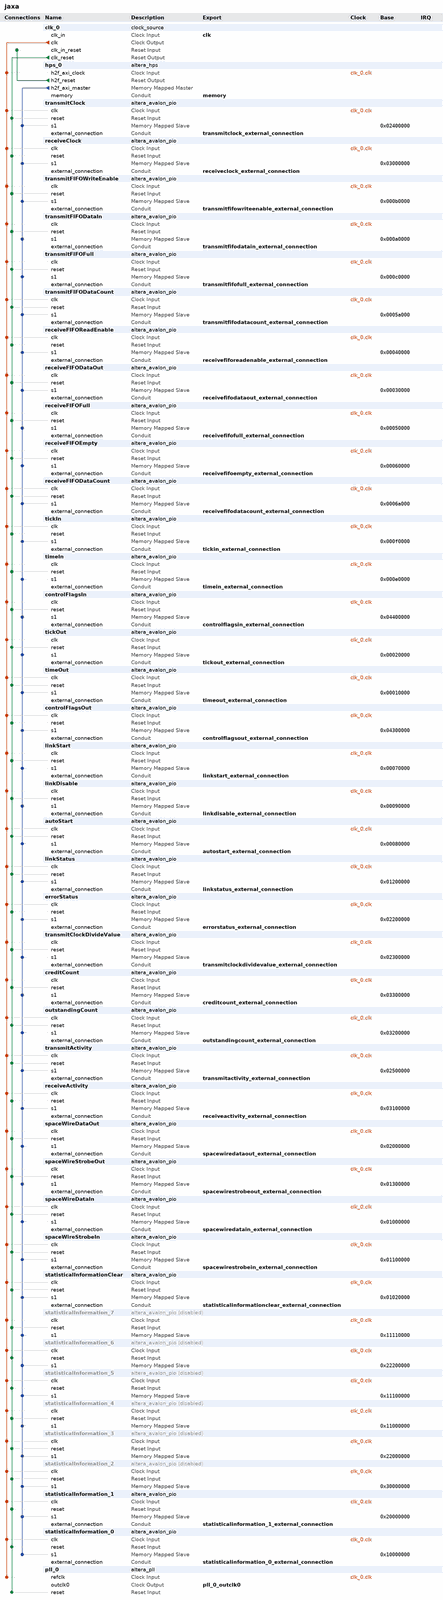
[diagram p0: system contents, whole]
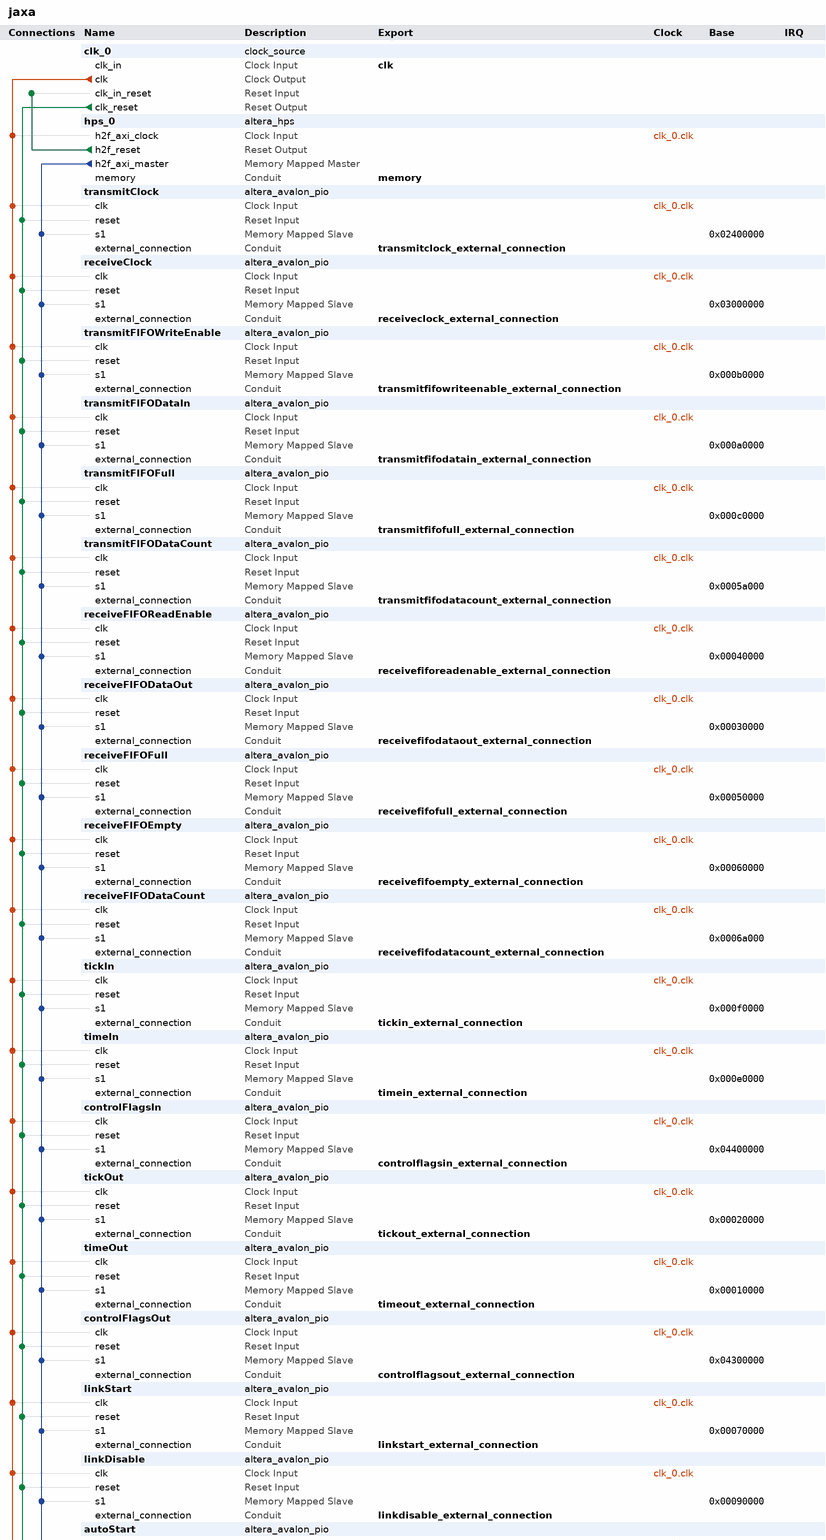
[diagram p1: system contents, upper part]
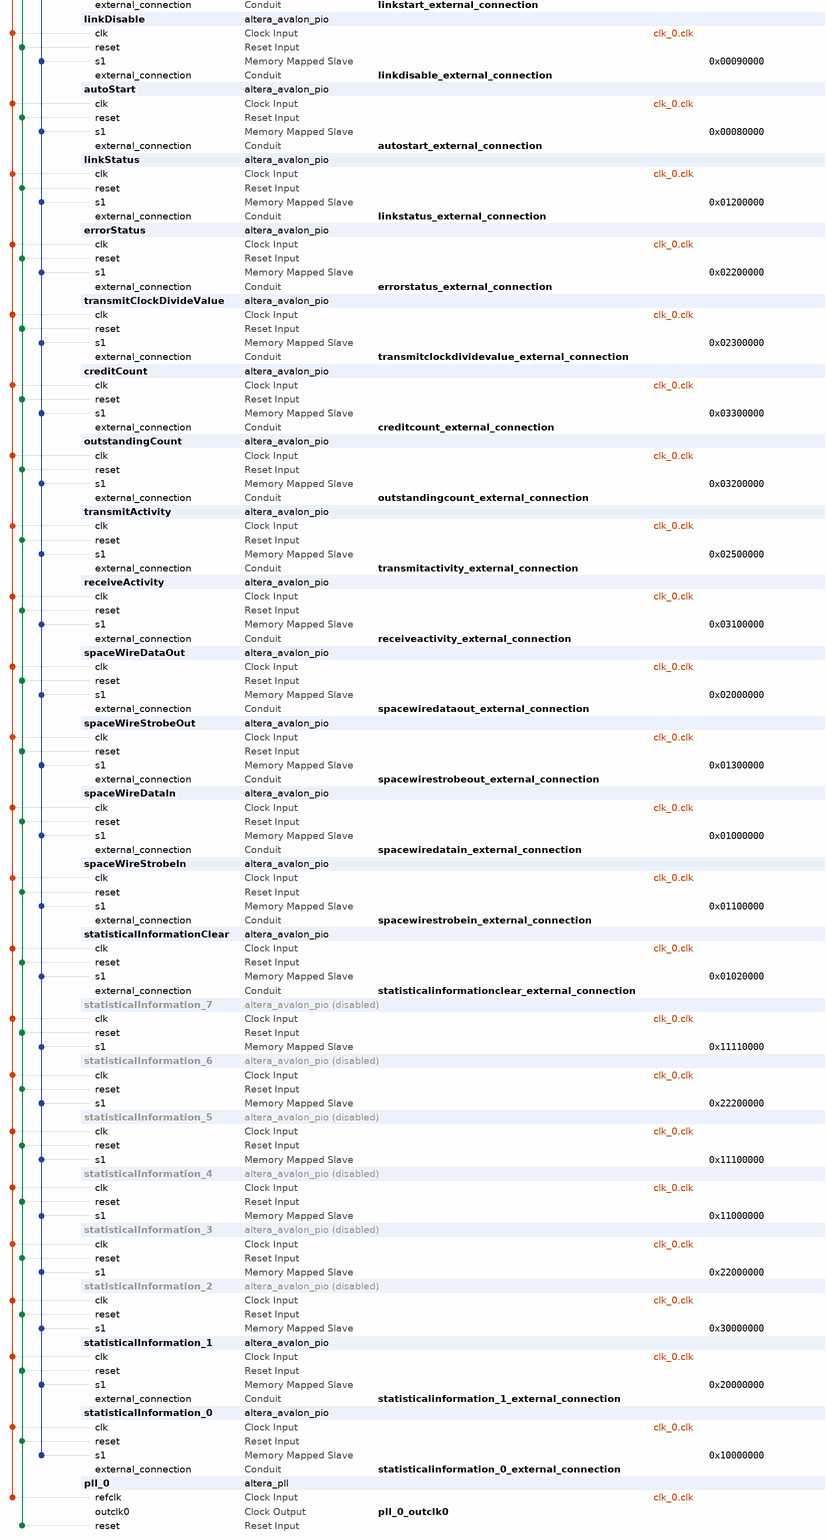
[diagram p2: system contents, lower part]
# Platform Designer (Qsys) system jaxa, Cyclone V 5CSEMA4U23C6
# Parameters at their usual value, and those the tool derives, are not listed.
package require -exact qsys 17.1
create_system jaxa
set_project_property DEVICE_FAMILY {Cyclone V}
set_project_property DEVICE 5CSEMA4U23C6

add_instance clk_0 clock_source 17.1
set_instance_parameter_value clk_0 clockFrequency 50000000

add_instance hps_0 altera_hps 17.1
set_instance_parameter_value hps_0 EMAC1_Mode N/A
set_instance_parameter_value hps_0 EMAC1_PinMuxing Unused
set_instance_parameter_value hps_0 F2SCLK_COLDRST_Enable false
set_instance_parameter_value hps_0 F2SCLK_DBGRST_Enable false
set_instance_parameter_value hps_0 F2SCLK_WARMRST_Enable false
set_instance_parameter_value hps_0 F2SINTERRUPT_Enable false
set_instance_parameter_value hps_0 F2S_Width 0
set_instance_parameter_value hps_0 FPGA_PERIPHERAL_OUTPUT_CLOCK_FREQ_EMAC0_GTX_CLK 125
set_instance_parameter_value hps_0 FPGA_PERIPHERAL_OUTPUT_CLOCK_FREQ_EMAC0_MD_CLK 2.5
set_instance_parameter_value hps_0 FPGA_PERIPHERAL_OUTPUT_CLOCK_FREQ_EMAC1_GTX_CLK 125
set_instance_parameter_value hps_0 FPGA_PERIPHERAL_OUTPUT_CLOCK_FREQ_EMAC1_MD_CLK 2.5
set_instance_parameter_value hps_0 HPS_PROTOCOL DDR3
set_instance_parameter_value hps_0 I2C0_Mode N/A
set_instance_parameter_value hps_0 I2C0_PinMuxing Unused
set_instance_parameter_value hps_0 I2C1_Mode N/A
set_instance_parameter_value hps_0 I2C1_PinMuxing Unused
set_instance_parameter_value hps_0 LWH2F_Enable false
set_instance_parameter_value hps_0 MEM_BANKADDR_WIDTH 3
set_instance_parameter_value hps_0 MEM_CLK_FREQ 300.0
set_instance_parameter_value hps_0 MEM_CLK_FREQ_MAX 400.0
set_instance_parameter_value hps_0 MEM_COL_ADDR_WIDTH 8
set_instance_parameter_value hps_0 MEM_DQ_WIDTH 8
set_instance_parameter_value hps_0 MEM_DRV_STR RZQ/6
set_instance_parameter_value hps_0 MEM_ROW_ADDR_WIDTH 12
set_instance_parameter_value hps_0 MEM_RTT_NOM {ODT Disabled}
set_instance_parameter_value hps_0 MEM_RTT_WR {Dynamic ODT off}
set_instance_parameter_value hps_0 MEM_TCL 7
set_instance_parameter_value hps_0 MEM_TFAW_NS 37.5
set_instance_parameter_value hps_0 MEM_TINIT_US 499
set_instance_parameter_value hps_0 MEM_TMRD_CK 3
set_instance_parameter_value hps_0 MEM_TRAS_NS 40.0
set_instance_parameter_value hps_0 MEM_TRCD_NS 15.0
set_instance_parameter_value hps_0 MEM_TREFI_US 7.0
set_instance_parameter_value hps_0 MEM_TRFC_NS 75.0
set_instance_parameter_value hps_0 MEM_TRP_NS 15.0
set_instance_parameter_value hps_0 MEM_TWTR 2
set_instance_parameter_value hps_0 MEM_VENDOR JEDEC
set_instance_parameter_value hps_0 MEM_WTCL 6
set_instance_parameter_value hps_0 QSPI_Mode N/A
set_instance_parameter_value hps_0 QSPI_PinMuxing Unused
set_instance_parameter_value hps_0 REF_CLK_FREQ 125.0
set_instance_parameter_value hps_0 S2FCLK_USER2CLK 5
set_instance_parameter_value hps_0 S2F_Width 1
set_instance_parameter_value hps_0 SDIO_Mode N/A
set_instance_parameter_value hps_0 SDIO_PinMuxing Unused
set_instance_parameter_value hps_0 SPIM1_Mode N/A
set_instance_parameter_value hps_0 SPIM1_PinMuxing Unused
set_instance_parameter_value hps_0 STM_Enable false
set_instance_parameter_value hps_0 TIMING_BOARD_AC_SKEW 0.02
set_instance_parameter_value hps_0 TIMING_BOARD_AC_TO_CK_SKEW 0.0
set_instance_parameter_value hps_0 TIMING_BOARD_DQ_TO_DQS_SKEW 0.0
set_instance_parameter_value hps_0 TIMING_BOARD_MAX_CK_DELAY 0.6
set_instance_parameter_value hps_0 TIMING_BOARD_MAX_DQS_DELAY 0.6
set_instance_parameter_value hps_0 TIMING_BOARD_SKEW_BETWEEN_DQS 0.02
set_instance_parameter_value hps_0 TIMING_BOARD_SKEW_CKDQS_DIMM_MAX 0.01
set_instance_parameter_value hps_0 TIMING_BOARD_SKEW_CKDQS_DIMM_MIN -0.01
set_instance_parameter_value hps_0 TIMING_BOARD_SKEW_WITHIN_DQS 0.02
set_instance_parameter_value hps_0 TIMING_TDH 125
set_instance_parameter_value hps_0 TIMING_TDQSCK 400
set_instance_parameter_value hps_0 TIMING_TDQSQ 120
set_instance_parameter_value hps_0 TIMING_TDS 50
set_instance_parameter_value hps_0 TIMING_TIH 250
set_instance_parameter_value hps_0 TIMING_TIS 175
set_instance_parameter_value hps_0 TIMING_TQSH 0.38
set_instance_parameter_value hps_0 UART0_Mode N/A
set_instance_parameter_value hps_0 UART0_PinMuxing Unused
set_instance_parameter_value hps_0 USB1_Mode N/A
set_instance_parameter_value hps_0 USB1_PinMuxing Unused
set_instance_parameter_value hps_0 desired_cfg_clk_mhz 100.0
set_instance_parameter_value hps_0 desired_qspi_clk_mhz 400.0
set_instance_parameter_value hps_0 eosc1_clk_mhz 50.0
set_instance_parameter_value hps_0 eosc2_clk_mhz 50.0

add_instance transmitClock altera_avalon_pio 17.1
set_instance_parameter_value transmitClock direction Output
set_instance_parameter_value transmitClock width 1

add_instance receiveClock altera_avalon_pio 17.1
set_instance_parameter_value receiveClock direction Output
set_instance_parameter_value receiveClock width 1

add_instance transmitFIFOWriteEnable altera_avalon_pio 17.1
set_instance_parameter_value transmitFIFOWriteEnable direction Output
set_instance_parameter_value transmitFIFOWriteEnable width 1

add_instance transmitFIFODataIn altera_avalon_pio 17.1
set_instance_parameter_value transmitFIFODataIn direction Output
set_instance_parameter_value transmitFIFODataIn width 9

add_instance transmitFIFOFull altera_avalon_pio 17.1
set_instance_parameter_value transmitFIFOFull direction Input
set_instance_parameter_value transmitFIFOFull width 1

add_instance transmitFIFODataCount altera_avalon_pio 17.1
set_instance_parameter_value transmitFIFODataCount direction Input
set_instance_parameter_value transmitFIFODataCount width 6

add_instance receiveFIFOReadEnable altera_avalon_pio 17.1
set_instance_parameter_value receiveFIFOReadEnable direction Output
set_instance_parameter_value receiveFIFOReadEnable width 1

add_instance receiveFIFODataOut altera_avalon_pio 17.1
set_instance_parameter_value receiveFIFODataOut direction Input
set_instance_parameter_value receiveFIFODataOut width 9

add_instance receiveFIFOFull altera_avalon_pio 17.1
set_instance_parameter_value receiveFIFOFull direction Input
set_instance_parameter_value receiveFIFOFull width 1

add_instance receiveFIFOEmpty altera_avalon_pio 17.1
set_instance_parameter_value receiveFIFOEmpty direction Input
set_instance_parameter_value receiveFIFOEmpty width 1

add_instance receiveFIFODataCount altera_avalon_pio 17.1
set_instance_parameter_value receiveFIFODataCount direction Input
set_instance_parameter_value receiveFIFODataCount width 1

add_instance tickIn altera_avalon_pio 17.1
set_instance_parameter_value tickIn direction Output
set_instance_parameter_value tickIn width 1

add_instance timeIn altera_avalon_pio 17.1
set_instance_parameter_value timeIn direction Output
set_instance_parameter_value timeIn width 6

add_instance controlFlagsIn altera_avalon_pio 17.1
set_instance_parameter_value controlFlagsIn direction Output
set_instance_parameter_value controlFlagsIn width 2

add_instance tickOut altera_avalon_pio 17.1
set_instance_parameter_value tickOut direction Input
set_instance_parameter_value tickOut width 1

add_instance timeOut altera_avalon_pio 17.1
set_instance_parameter_value timeOut direction Input
set_instance_parameter_value timeOut width 6

add_instance controlFlagsOut altera_avalon_pio 17.1
set_instance_parameter_value controlFlagsOut direction Input
set_instance_parameter_value controlFlagsOut width 2

add_instance linkStart altera_avalon_pio 17.1
set_instance_parameter_value linkStart direction Output
set_instance_parameter_value linkStart width 1

add_instance linkDisable altera_avalon_pio 17.1
set_instance_parameter_value linkDisable direction Output
set_instance_parameter_value linkDisable width 1

add_instance autoStart altera_avalon_pio 17.1
set_instance_parameter_value autoStart direction Output
set_instance_parameter_value autoStart width 1

add_instance linkStatus altera_avalon_pio 17.1
set_instance_parameter_value linkStatus direction Input
set_instance_parameter_value linkStatus width 16

add_instance errorStatus altera_avalon_pio 17.1
set_instance_parameter_value errorStatus direction Input
set_instance_parameter_value errorStatus width 8

add_instance transmitClockDivideValue altera_avalon_pio 17.1
set_instance_parameter_value transmitClockDivideValue direction Output
set_instance_parameter_value transmitClockDivideValue width 6

add_instance creditCount altera_avalon_pio 17.1
set_instance_parameter_value creditCount direction Input
set_instance_parameter_value creditCount width 6

add_instance outstandingCount altera_avalon_pio 17.1
set_instance_parameter_value outstandingCount direction Input
set_instance_parameter_value outstandingCount width 6

add_instance transmitActivity altera_avalon_pio 17.1
set_instance_parameter_value transmitActivity direction Input
set_instance_parameter_value transmitActivity width 1

add_instance receiveActivity altera_avalon_pio 17.1
set_instance_parameter_value receiveActivity direction Input
set_instance_parameter_value receiveActivity width 1

add_instance spaceWireDataOut altera_avalon_pio 17.1
set_instance_parameter_value spaceWireDataOut direction Input
set_instance_parameter_value spaceWireDataOut width 1

add_instance spaceWireStrobeOut altera_avalon_pio 17.1
set_instance_parameter_value spaceWireStrobeOut direction Input
set_instance_parameter_value spaceWireStrobeOut width 1

add_instance spaceWireDataIn altera_avalon_pio 17.1
set_instance_parameter_value spaceWireDataIn direction Output
set_instance_parameter_value spaceWireDataIn width 1

add_instance spaceWireStrobeIn altera_avalon_pio 17.1
set_instance_parameter_value spaceWireStrobeIn direction Output
set_instance_parameter_value spaceWireStrobeIn width 1

add_instance statisticalInformationClear altera_avalon_pio 17.1
set_instance_parameter_value statisticalInformationClear direction Output
set_instance_parameter_value statisticalInformationClear width 1

add_instance statisticalInformation_7 altera_avalon_pio 17.1
set_instance_property statisticalInformation_7 ENABLED false
set_instance_parameter_value statisticalInformation_7 direction Input
set_instance_parameter_value statisticalInformation_7 width 32

add_instance statisticalInformation_6 altera_avalon_pio 17.1
set_instance_property statisticalInformation_6 ENABLED false
set_instance_parameter_value statisticalInformation_6 direction Input
set_instance_parameter_value statisticalInformation_6 width 32

add_instance statisticalInformation_5 altera_avalon_pio 17.1
set_instance_property statisticalInformation_5 ENABLED false
set_instance_parameter_value statisticalInformation_5 direction Input
set_instance_parameter_value statisticalInformation_5 width 32

add_instance statisticalInformation_4 altera_avalon_pio 17.1
set_instance_property statisticalInformation_4 ENABLED false
set_instance_parameter_value statisticalInformation_4 direction Input
set_instance_parameter_value statisticalInformation_4 width 32

add_instance statisticalInformation_3 altera_avalon_pio 17.1
set_instance_property statisticalInformation_3 ENABLED false
set_instance_parameter_value statisticalInformation_3 direction Input
set_instance_parameter_value statisticalInformation_3 width 32

add_instance statisticalInformation_2 altera_avalon_pio 17.1
set_instance_property statisticalInformation_2 ENABLED false
set_instance_parameter_value statisticalInformation_2 direction Input
set_instance_parameter_value statisticalInformation_2 width 32

add_instance statisticalInformation_1 altera_avalon_pio 17.1
set_instance_parameter_value statisticalInformation_1 direction Output
set_instance_parameter_value statisticalInformation_1 width 8

add_instance statisticalInformation_0 altera_avalon_pio 17.1
set_instance_parameter_value statisticalInformation_0 direction Input
set_instance_parameter_value statisticalInformation_0 width 32

add_instance pll_0 altera_pll 17.1
set_instance_parameter_value pll_0 gui_device_speed_grade 1
set_instance_parameter_value pll_0 gui_number_of_clocks 1
set_instance_parameter_value pll_0 gui_operation_mode direct
set_instance_parameter_value pll_0 gui_output_clock_frequency0 100.0
set_instance_parameter_value pll_0 gui_pll_mode {Integer-N PLL}
set_instance_parameter_value pll_0 gui_reference_clock_frequency 100.0
set_instance_parameter_value pll_0 gui_use_locked true

# connections
add_connection clk_0.clk autoStart.clk clock
add_connection clk_0.clk controlFlagsIn.clk clock
add_connection clk_0.clk controlFlagsOut.clk clock
add_connection clk_0.clk creditCount.clk clock
add_connection clk_0.clk errorStatus.clk clock
add_connection clk_0.clk hps_0.h2f_axi_clock clock
add_connection clk_0.clk linkDisable.clk clock
add_connection clk_0.clk linkStart.clk clock
add_connection clk_0.clk linkStatus.clk clock
add_connection clk_0.clk outstandingCount.clk clock
add_connection clk_0.clk pll_0.refclk clock
add_connection clk_0.clk receiveActivity.clk clock
add_connection clk_0.clk receiveClock.clk clock
add_connection clk_0.clk receiveFIFODataCount.clk clock
add_connection clk_0.clk receiveFIFODataOut.clk clock
add_connection clk_0.clk receiveFIFOEmpty.clk clock
add_connection clk_0.clk receiveFIFOFull.clk clock
add_connection clk_0.clk receiveFIFOReadEnable.clk clock
add_connection clk_0.clk spaceWireDataIn.clk clock
add_connection clk_0.clk spaceWireDataOut.clk clock
add_connection clk_0.clk spaceWireStrobeIn.clk clock
add_connection clk_0.clk spaceWireStrobeOut.clk clock
add_connection clk_0.clk statisticalInformation_0.clk clock
add_connection clk_0.clk statisticalInformation_1.clk clock
add_connection clk_0.clk statisticalInformation_2.clk clock
add_connection clk_0.clk statisticalInformation_3.clk clock
add_connection clk_0.clk statisticalInformation_4.clk clock
add_connection clk_0.clk statisticalInformation_5.clk clock
add_connection clk_0.clk statisticalInformation_6.clk clock
add_connection clk_0.clk statisticalInformation_7.clk clock
add_connection clk_0.clk statisticalInformationClear.clk clock
add_connection clk_0.clk tickIn.clk clock
add_connection clk_0.clk tickOut.clk clock
add_connection clk_0.clk timeIn.clk clock
add_connection clk_0.clk timeOut.clk clock
add_connection clk_0.clk transmitActivity.clk clock
add_connection clk_0.clk transmitClock.clk clock
add_connection clk_0.clk transmitClockDivideValue.clk clock
add_connection clk_0.clk transmitFIFODataCount.clk clock
add_connection clk_0.clk transmitFIFODataIn.clk clock
add_connection clk_0.clk transmitFIFOFull.clk clock
add_connection clk_0.clk transmitFIFOWriteEnable.clk clock
add_connection clk_0.clk_reset autoStart.reset reset
add_connection clk_0.clk_reset controlFlagsIn.reset reset
add_connection clk_0.clk_reset controlFlagsOut.reset reset
add_connection clk_0.clk_reset creditCount.reset reset
add_connection clk_0.clk_reset errorStatus.reset reset
add_connection clk_0.clk_reset linkDisable.reset reset
add_connection clk_0.clk_reset linkStart.reset reset
add_connection clk_0.clk_reset linkStatus.reset reset
add_connection clk_0.clk_reset outstandingCount.reset reset
add_connection clk_0.clk_reset pll_0.reset reset
add_connection clk_0.clk_reset receiveActivity.reset reset
add_connection clk_0.clk_reset receiveClock.reset reset
add_connection clk_0.clk_reset receiveFIFODataCount.reset reset
add_connection clk_0.clk_reset receiveFIFODataOut.reset reset
add_connection clk_0.clk_reset receiveFIFOEmpty.reset reset
add_connection clk_0.clk_reset receiveFIFOFull.reset reset
add_connection clk_0.clk_reset receiveFIFOReadEnable.reset reset
add_connection clk_0.clk_reset spaceWireDataIn.reset reset
add_connection clk_0.clk_reset spaceWireDataOut.reset reset
add_connection clk_0.clk_reset spaceWireStrobeIn.reset reset
add_connection clk_0.clk_reset spaceWireStrobeOut.reset reset
add_connection clk_0.clk_reset statisticalInformation_0.reset reset
add_connection clk_0.clk_reset statisticalInformation_1.reset reset
add_connection clk_0.clk_reset statisticalInformation_2.reset reset
add_connection clk_0.clk_reset statisticalInformation_3.reset reset
add_connection clk_0.clk_reset statisticalInformation_4.reset reset
add_connection clk_0.clk_reset statisticalInformation_5.reset reset
add_connection clk_0.clk_reset statisticalInformation_6.reset reset
add_connection clk_0.clk_reset statisticalInformation_7.reset reset
add_connection clk_0.clk_reset statisticalInformationClear.reset reset
add_connection clk_0.clk_reset tickIn.reset reset
add_connection clk_0.clk_reset tickOut.reset reset
add_connection clk_0.clk_reset timeIn.reset reset
add_connection clk_0.clk_reset timeOut.reset reset
add_connection clk_0.clk_reset transmitActivity.reset reset
add_connection clk_0.clk_reset transmitClock.reset reset
add_connection clk_0.clk_reset transmitClockDivideValue.reset reset
add_connection clk_0.clk_reset transmitFIFODataCount.reset reset
add_connection clk_0.clk_reset transmitFIFODataIn.reset reset
add_connection clk_0.clk_reset transmitFIFOFull.reset reset
add_connection clk_0.clk_reset transmitFIFOWriteEnable.reset reset
add_connection hps_0.h2f_reset clk_0.clk_in_reset reset
add_connection hps_0.h2f_axi_master autoStart.s1 avalon
set_connection_parameter_value hps_0.h2f_axi_master/autoStart.s1 baseAddress 0x00080000
add_connection hps_0.h2f_axi_master controlFlagsIn.s1 avalon
set_connection_parameter_value hps_0.h2f_axi_master/controlFlagsIn.s1 baseAddress 0x04400000
add_connection hps_0.h2f_axi_master controlFlagsOut.s1 avalon
set_connection_parameter_value hps_0.h2f_axi_master/controlFlagsOut.s1 baseAddress 0x04300000
add_connection hps_0.h2f_axi_master creditCount.s1 avalon
set_connection_parameter_value hps_0.h2f_axi_master/creditCount.s1 baseAddress 0x03300000
add_connection hps_0.h2f_axi_master errorStatus.s1 avalon
set_connection_parameter_value hps_0.h2f_axi_master/errorStatus.s1 baseAddress 0x02200000
add_connection hps_0.h2f_axi_master linkDisable.s1 avalon
set_connection_parameter_value hps_0.h2f_axi_master/linkDisable.s1 baseAddress 0x00090000
add_connection hps_0.h2f_axi_master linkStart.s1 avalon
set_connection_parameter_value hps_0.h2f_axi_master/linkStart.s1 baseAddress 0x00070000
add_connection hps_0.h2f_axi_master linkStatus.s1 avalon
set_connection_parameter_value hps_0.h2f_axi_master/linkStatus.s1 baseAddress 0x01200000
add_connection hps_0.h2f_axi_master outstandingCount.s1 avalon
set_connection_parameter_value hps_0.h2f_axi_master/outstandingCount.s1 baseAddress 0x03200000
add_connection hps_0.h2f_axi_master receiveActivity.s1 avalon
set_connection_parameter_value hps_0.h2f_axi_master/receiveActivity.s1 baseAddress 0x03100000
add_connection hps_0.h2f_axi_master receiveClock.s1 avalon
set_connection_parameter_value hps_0.h2f_axi_master/receiveClock.s1 baseAddress 0x03000000
add_connection hps_0.h2f_axi_master receiveFIFODataCount.s1 avalon
set_connection_parameter_value hps_0.h2f_axi_master/receiveFIFODataCount.s1 baseAddress 0x0006a000
add_connection hps_0.h2f_axi_master receiveFIFODataOut.s1 avalon
set_connection_parameter_value hps_0.h2f_axi_master/receiveFIFODataOut.s1 baseAddress 0x00030000
add_connection hps_0.h2f_axi_master receiveFIFOEmpty.s1 avalon
set_connection_parameter_value hps_0.h2f_axi_master/receiveFIFOEmpty.s1 baseAddress 0x00060000
add_connection hps_0.h2f_axi_master receiveFIFOFull.s1 avalon
set_connection_parameter_value hps_0.h2f_axi_master/receiveFIFOFull.s1 baseAddress 0x00050000
add_connection hps_0.h2f_axi_master receiveFIFOReadEnable.s1 avalon
set_connection_parameter_value hps_0.h2f_axi_master/receiveFIFOReadEnable.s1 baseAddress 0x00040000
add_connection hps_0.h2f_axi_master spaceWireDataIn.s1 avalon
set_connection_parameter_value hps_0.h2f_axi_master/spaceWireDataIn.s1 baseAddress 0x01000000
add_connection hps_0.h2f_axi_master spaceWireDataOut.s1 avalon
set_connection_parameter_value hps_0.h2f_axi_master/spaceWireDataOut.s1 baseAddress 0x02000000
add_connection hps_0.h2f_axi_master spaceWireStrobeIn.s1 avalon
set_connection_parameter_value hps_0.h2f_axi_master/spaceWireStrobeIn.s1 baseAddress 0x01100000
add_connection hps_0.h2f_axi_master spaceWireStrobeOut.s1 avalon
set_connection_parameter_value hps_0.h2f_axi_master/spaceWireStrobeOut.s1 baseAddress 0x01300000
add_connection hps_0.h2f_axi_master statisticalInformation_0.s1 avalon
set_connection_parameter_value hps_0.h2f_axi_master/statisticalInformation_0.s1 baseAddress 0x10000000
add_connection hps_0.h2f_axi_master statisticalInformation_1.s1 avalon
set_connection_parameter_value hps_0.h2f_axi_master/statisticalInformation_1.s1 baseAddress 0x20000000
add_connection hps_0.h2f_axi_master statisticalInformation_2.s1 avalon
set_connection_parameter_value hps_0.h2f_axi_master/statisticalInformation_2.s1 baseAddress 0x30000000
add_connection hps_0.h2f_axi_master statisticalInformation_3.s1 avalon
set_connection_parameter_value hps_0.h2f_axi_master/statisticalInformation_3.s1 baseAddress 0x22000000
add_connection hps_0.h2f_axi_master statisticalInformation_4.s1 avalon
set_connection_parameter_value hps_0.h2f_axi_master/statisticalInformation_4.s1 baseAddress 0x11000000
add_connection hps_0.h2f_axi_master statisticalInformation_5.s1 avalon
set_connection_parameter_value hps_0.h2f_axi_master/statisticalInformation_5.s1 baseAddress 0x11100000
add_connection hps_0.h2f_axi_master statisticalInformation_6.s1 avalon
set_connection_parameter_value hps_0.h2f_axi_master/statisticalInformation_6.s1 baseAddress 0x22200000
add_connection hps_0.h2f_axi_master statisticalInformation_7.s1 avalon
set_connection_parameter_value hps_0.h2f_axi_master/statisticalInformation_7.s1 baseAddress 0x11110000
add_connection hps_0.h2f_axi_master statisticalInformationClear.s1 avalon
set_connection_parameter_value hps_0.h2f_axi_master/statisticalInformationClear.s1 baseAddress 0x01020000
add_connection hps_0.h2f_axi_master tickIn.s1 avalon
set_connection_parameter_value hps_0.h2f_axi_master/tickIn.s1 baseAddress 0x000f0000
add_connection hps_0.h2f_axi_master tickOut.s1 avalon
set_connection_parameter_value hps_0.h2f_axi_master/tickOut.s1 baseAddress 0x00020000
add_connection hps_0.h2f_axi_master timeIn.s1 avalon
set_connection_parameter_value hps_0.h2f_axi_master/timeIn.s1 baseAddress 0x000e0000
add_connection hps_0.h2f_axi_master timeOut.s1 avalon
set_connection_parameter_value hps_0.h2f_axi_master/timeOut.s1 baseAddress 0x00010000
add_connection hps_0.h2f_axi_master transmitActivity.s1 avalon
set_connection_parameter_value hps_0.h2f_axi_master/transmitActivity.s1 baseAddress 0x02500000
add_connection hps_0.h2f_axi_master transmitClock.s1 avalon
set_connection_parameter_value hps_0.h2f_axi_master/transmitClock.s1 baseAddress 0x02400000
add_connection hps_0.h2f_axi_master transmitClockDivideValue.s1 avalon
set_connection_parameter_value hps_0.h2f_axi_master/transmitClockDivideValue.s1 baseAddress 0x02300000
add_connection hps_0.h2f_axi_master transmitFIFODataCount.s1 avalon
set_connection_parameter_value hps_0.h2f_axi_master/transmitFIFODataCount.s1 baseAddress 0x0005a000
add_connection hps_0.h2f_axi_master transmitFIFODataIn.s1 avalon
set_connection_parameter_value hps_0.h2f_axi_master/transmitFIFODataIn.s1 baseAddress 0x000a0000
add_connection hps_0.h2f_axi_master transmitFIFOFull.s1 avalon
set_connection_parameter_value hps_0.h2f_axi_master/transmitFIFOFull.s1 baseAddress 0x000c0000
add_connection hps_0.h2f_axi_master transmitFIFOWriteEnable.s1 avalon
set_connection_parameter_value hps_0.h2f_axi_master/transmitFIFOWriteEnable.s1 baseAddress 0x000b0000

# exported interfaces
add_interface autostart_external_connection conduit end
set_interface_property autostart_external_connection EXPORT_OF autoStart.external_connection
add_interface clk clock sink
set_interface_property clk EXPORT_OF clk_0.clk_in
add_interface controlflagsin_external_connection conduit end
set_interface_property controlflagsin_external_connection EXPORT_OF controlFlagsIn.external_connection
add_interface controlflagsout_external_connection conduit end
set_interface_property controlflagsout_external_connection EXPORT_OF controlFlagsOut.external_connection
add_interface creditcount_external_connection conduit end
set_interface_property creditcount_external_connection EXPORT_OF creditCount.external_connection
add_interface errorstatus_external_connection conduit end
set_interface_property errorstatus_external_connection EXPORT_OF errorStatus.external_connection
add_interface linkdisable_external_connection conduit end
set_interface_property linkdisable_external_connection EXPORT_OF linkDisable.external_connection
add_interface linkstart_external_connection conduit end
set_interface_property linkstart_external_connection EXPORT_OF linkStart.external_connection
add_interface linkstatus_external_connection conduit end
set_interface_property linkstatus_external_connection EXPORT_OF linkStatus.external_connection
add_interface memory conduit end
set_interface_property memory EXPORT_OF hps_0.memory
add_interface outstandingcount_external_connection conduit end
set_interface_property outstandingcount_external_connection EXPORT_OF outstandingCount.external_connection
add_interface pll_0_outclk0 clock source
set_interface_property pll_0_outclk0 EXPORT_OF pll_0.outclk0
add_interface receiveactivity_external_connection conduit end
set_interface_property receiveactivity_external_connection EXPORT_OF receiveActivity.external_connection
add_interface receiveclock_external_connection conduit end
set_interface_property receiveclock_external_connection EXPORT_OF receiveClock.external_connection
add_interface receivefifodatacount_external_connection conduit end
set_interface_property receivefifodatacount_external_connection EXPORT_OF receiveFIFODataCount.external_connection
add_interface receivefifodataout_external_connection conduit end
set_interface_property receivefifodataout_external_connection EXPORT_OF receiveFIFODataOut.external_connection
add_interface receivefifoempty_external_connection conduit end
set_interface_property receivefifoempty_external_connection EXPORT_OF receiveFIFOEmpty.external_connection
add_interface receivefifofull_external_connection conduit end
set_interface_property receivefifofull_external_connection EXPORT_OF receiveFIFOFull.external_connection
add_interface receivefiforeadenable_external_connection conduit end
set_interface_property receivefiforeadenable_external_connection EXPORT_OF receiveFIFOReadEnable.external_connection
add_interface spacewiredatain_external_connection conduit end
set_interface_property spacewiredatain_external_connection EXPORT_OF spaceWireDataIn.external_connection
add_interface spacewiredataout_external_connection conduit end
set_interface_property spacewiredataout_external_connection EXPORT_OF spaceWireDataOut.external_connection
add_interface spacewirestrobein_external_connection conduit end
set_interface_property spacewirestrobein_external_connection EXPORT_OF spaceWireStrobeIn.external_connection
add_interface spacewirestrobeout_external_connection conduit end
set_interface_property spacewirestrobeout_external_connection EXPORT_OF spaceWireStrobeOut.external_connection
add_interface statisticalinformation_0_external_connection conduit end
set_interface_property statisticalinformation_0_external_connection EXPORT_OF statisticalInformation_0.external_connection
add_interface statisticalinformation_1_external_connection conduit end
set_interface_property statisticalinformation_1_external_connection EXPORT_OF statisticalInformation_1.external_connection
add_interface statisticalinformationclear_external_connection conduit end
set_interface_property statisticalinformationclear_external_connection EXPORT_OF statisticalInformationClear.external_connection
add_interface tickin_external_connection conduit end
set_interface_property tickin_external_connection EXPORT_OF tickIn.external_connection
add_interface tickout_external_connection conduit end
set_interface_property tickout_external_connection EXPORT_OF tickOut.external_connection
add_interface timein_external_connection conduit end
set_interface_property timein_external_connection EXPORT_OF timeIn.external_connection
add_interface timeout_external_connection conduit end
set_interface_property timeout_external_connection EXPORT_OF timeOut.external_connection
add_interface transmitactivity_external_connection conduit end
set_interface_property transmitactivity_external_connection EXPORT_OF transmitActivity.external_connection
add_interface transmitclock_external_connection conduit end
set_interface_property transmitclock_external_connection EXPORT_OF transmitClock.external_connection
add_interface transmitclockdividevalue_external_connection conduit end
set_interface_property transmitclockdividevalue_external_connection EXPORT_OF transmitClockDivideValue.external_connection
add_interface transmitfifodatacount_external_connection conduit end
set_interface_property transmitfifodatacount_external_connection EXPORT_OF transmitFIFODataCount.external_connection
add_interface transmitfifodatain_external_connection conduit end
set_interface_property transmitfifodatain_external_connection EXPORT_OF transmitFIFODataIn.external_connection
add_interface transmitfifofull_external_connection conduit end
set_interface_property transmitfifofull_external_connection EXPORT_OF transmitFIFOFull.external_connection
add_interface transmitfifowriteenable_external_connection conduit end
set_interface_property transmitfifowriteenable_external_connection EXPORT_OF transmitFIFOWriteEnable.external_connection

set_interconnect_requirement {$system} qsys_mm.clockCrossingAdapter HANDSHAKE
set_interconnect_requirement {$system} qsys_mm.enableEccProtection FALSE
set_interconnect_requirement {$system} qsys_mm.insertDefaultSlave FALSE
set_interconnect_requirement {$system} qsys_mm.maxAdditionalLatency 1

save_system jaxa.qsys
